# Altium schematic sheet HiSpeedADC2.SchDoc: E53高速ADC拓展模块
size A4; DrawnBy: Ma Siqing; Revision: 2021-1-11V1; SheetNumber: 1 of 1
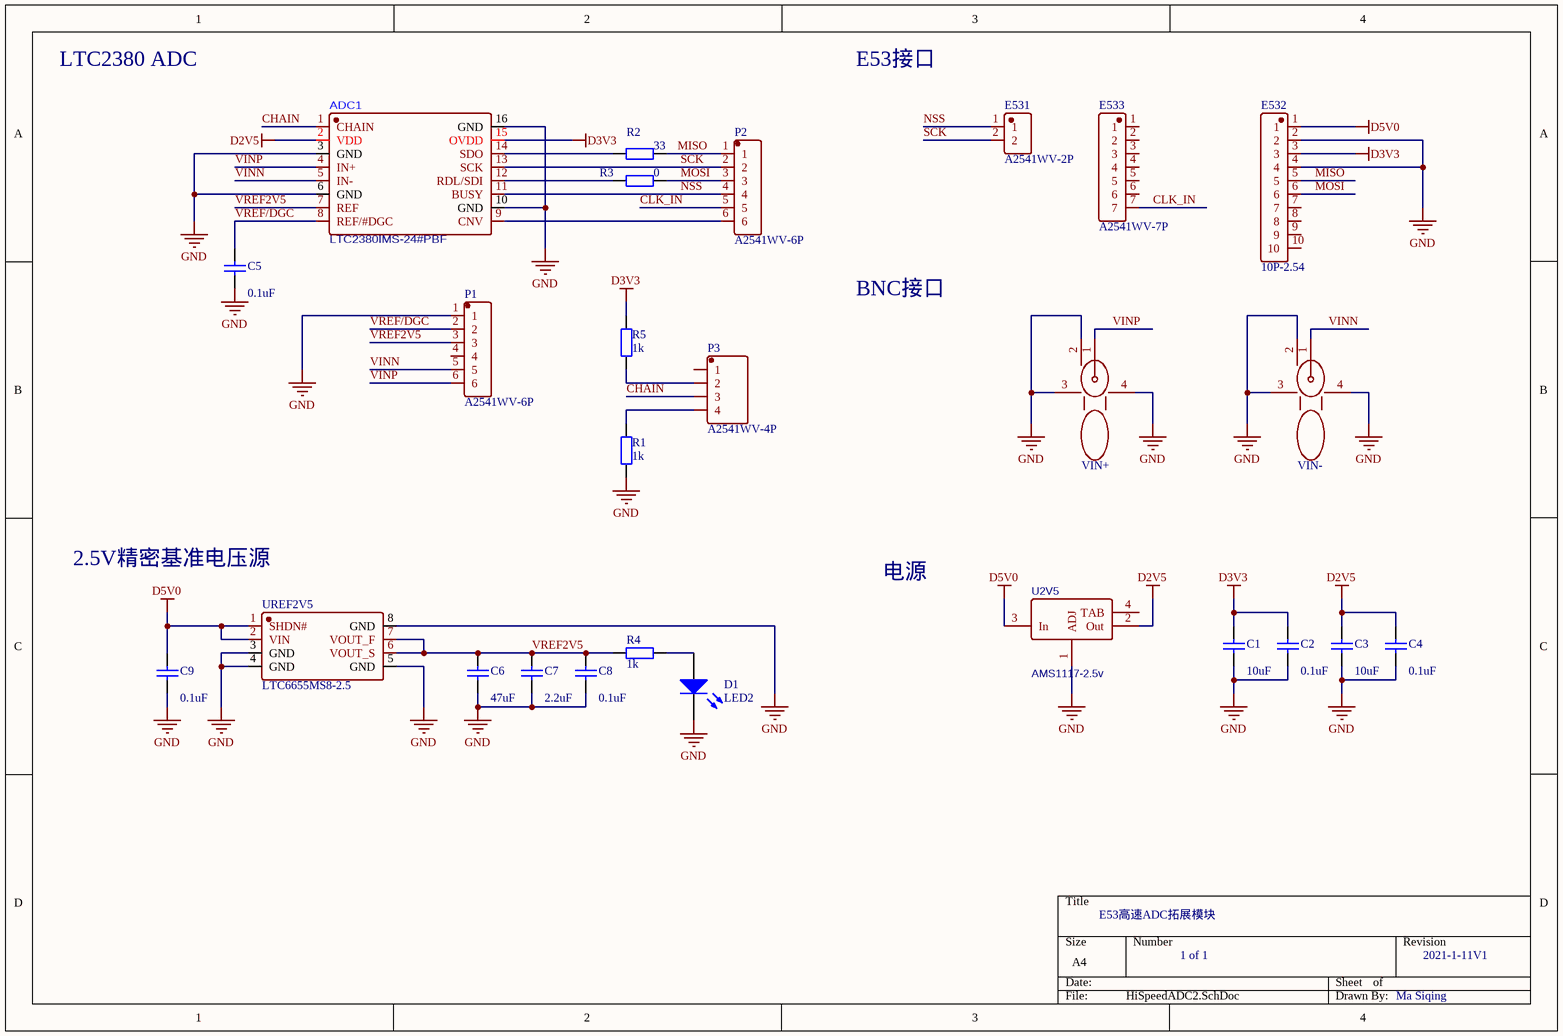
[diagram p0: HiSpeedADC2.SchDoc]

## Parts
ADC1  LTC2380IMS-24#PBF  [MSOP-16_L4.0-W3.0-P0.50-LS4.9-BL]
C1  value 10uF  [C1206]
C2  value 0.1uF  [C1206]
C3  value 10uF  [C1206]
C4  value 0.1uF  [C1206]
C5  value 0.1uF  [C1206]
C6  value 47uF  [C1206]
C7  value 2.2uF  [C1206]
C8  value 0.1uF  [C1206]
C9  value 0.1uF  [C1206]
D1  LED2  [3.2X1.6X1.1]
E531  A2541WV-2P  [HDR-TH_P2.54-H-M_A2541WV-2P]
E532  10P-2.54  [HDR-TH_10P-P2.54-V]
E533  A2541WV-7P  [HDR-TH_7P-P2.54-V]
P1  A2541WV-6P  [HDR-TH_6P-P2.54-V]
P2  A2541WV-6P  [HDR-TH_6P-P2.54-V]
P3  A2541WV-4P  [HDR-TH_4P-P2.54-V]
R1  1k  [0805_R]
R2  33  [0805_R]
R3  0  [0805_R]
R4  1k  [0805_R]
R5  1k  [0805_R]
U2V5  AMS1117-2.5v  [SOT-223_L6.7-W3.5-P2.30-BR]
UREF2V5  LTC6655MS8-2.5  [MSOP-8_L3.0-W3.0-P0.65-LS4.9-BL]
VIN+  BNC1  [BNC-TH_DOSIN-801-0072]  (value not drawn)
VIN-  BNC  [BNC-TH_DOSIN-801-0072]  (value not drawn)

## Nets
D2V5: ADC1.2(VDD) C3.1 C4.1 U2V5.2(Out)
D3V3: ADC1.15(OVDD) C1.1 C2.1 E532.3 R5.2
D5V0: C9.1 E532.1 U2V5.3(In) UREF2V5.1(SHDN#) UREF2V5.2(VIN)
GND: ADC1.3(GND) ADC1.6(GND) ADC1.10(GND) ADC1.16(GND) C1.2 C2.2 C3.2 C4.2 C5.2 C6.2 C7.2 C8.2 C9.2 D1.2(K) E532.2 E532.4 P1.1 R1.1 U2V5.1(ADJ) UREF2V5.3(GND) UREF2V5.4(GND) UREF2V5.5(GND) UREF2V5.8(GND) VIN+.2 VIN+.3 VIN+.4 VIN-.2 VIN-.3 VIN-.4
CHAIN: ADC1.1(CHAIN) P3.3
CLK_IN: E533.7 P2.5
MISO: E532.5 P2.1 R2.2
MOSI: E532.6 P2.3 R3.2
NSS: ADC1.11(BUSY) E531.1 P2.4
SCK: ADC1.13(SCK) E531.2 P2.2
VINN: ADC1.5(IN-) P1.5 VIN-.1
VINP: ADC1.4(IN+) P1.6 VIN+.1
VREF2V5: ADC1.7(REF) C6.1 C7.1 C8.1 P1.3 R4.1 UREF2V5.6(VOUT_S) UREF2V5.7(VOUT_F)
VREF/DGC: ADC1.8(REF/#DGC) C5.1 P1.2
NetADC1_9: ADC1.9(CNV) P2.6
NetADC1_12: ADC1.12(RDL/SDI) R3.1
NetADC1_14: ADC1.14(SDO) R2.1
NetD1_1: D1.1(A) R4.2
NetP3_2: P3.2 R5.1
NetP3_4: P3.4 R1.2

Not connected (* = marked no-connect by the designer): E532 7 8 9 10; E533 1 2 3 4 5 6; P1 4; P3 1; U2V5 4(TAB)

## Notes on the sheet
- LTC2380 ADC
- E53接口
- BNC接口
- 2.5V精密基准电压源
- 电源

## Library data of the parts
C1-C9 = Cap Semi: Capacitor (Semiconductor SIM Model); Published: 8-Jun-2000; LatestRevisionDate: 29-May-2009; LatestRevisionNote: IPC-7351 Footprint Added.; PackageReference: C1206; Publisher: Altium Limited; PackageDescription: Chip Capacitor
D1 = LED2: Typical RED, GREEN, YELLOW, AMBER GaAs LED; Published: 8-Jun-2000; LatestRevisionDate: 17-Jul-2002; LatestRevisionNote: Re-released for DXP Platform.; PackageVersion: Feb-2002; PackageReference: 3.2X1.6X1.1; Publisher: Altium Limited; PackageDescription: SM LED; 2 Flat Leads
R1-R5 = Res_0805: 0805贴片电阻; ComponentLink1Description: 供应商链接; ComponentLink1URL: http://www.szlcsc.com/product/details_26856.html; Package: 0805; Supplier: LC; SuppliersPartNumber: C26113
U2V5 = AMS1117-ADJ: BOM_Manufacturer: AMS; sourceId: 0btnFXRxP; Contributor: GerryChen; SMT Type: Extend; BOM_Supplier: LCSC; BOM_Manufacturer Part: AMS1117-ADJ; image: //image.lceda.cn/szlcsc/C6188.jpg; BOM_Supplier Part: C6188; BOM_JLCPCB SMD: Yes; spicePre: U; spiceSymbolName: AMS1117-ADJ
UREF2V5 = LTC6655MS8-5
VIN+ = BNC